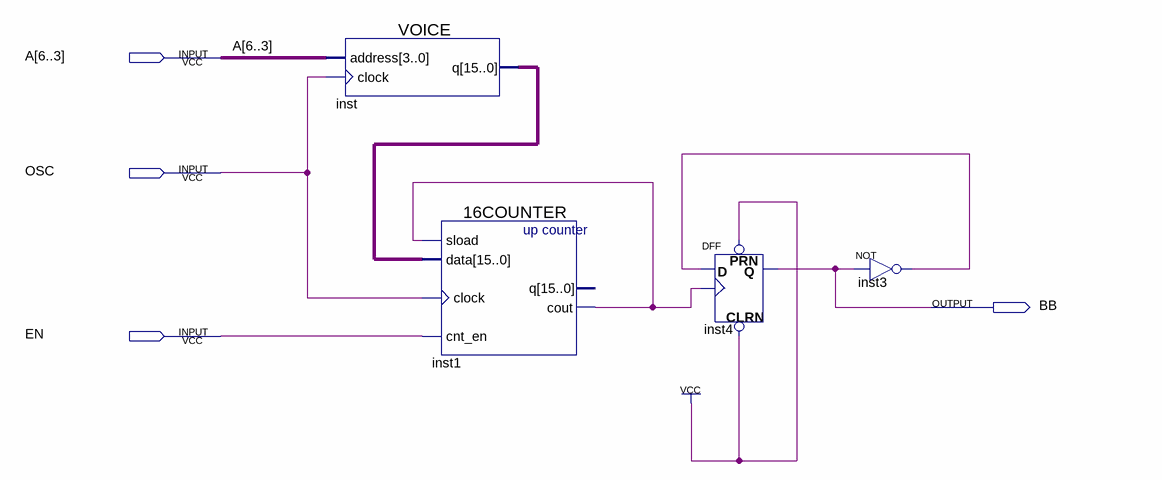
[diagram p0: schematic sheet]
// Quartus schematic BB.bdf as structural Verilog: 4 symbols, 4 pins
module BB (
  input  [6:3] A,
  input  OSC,
  input  EN,
  output BB
);

  wire inst1_cout, inst3_out;
  wire [15:0] inst_q;

  VOICE inst (.address(A), .clock(OSC), .q(inst_q));
  \16COUNTER  inst1 (.sload(inst1_cout), .data(inst_q), .clock(OSC), .cnt_en(EN), .cout(inst1_cout));  // open: q
  DFF inst4 (.CLRN(1'b1), .CLK(inst1_cout), .D(inst3_out), .PRN(1'b1), .Q(BB));
  not inst3 (inst3_out, BB);
endmodule
